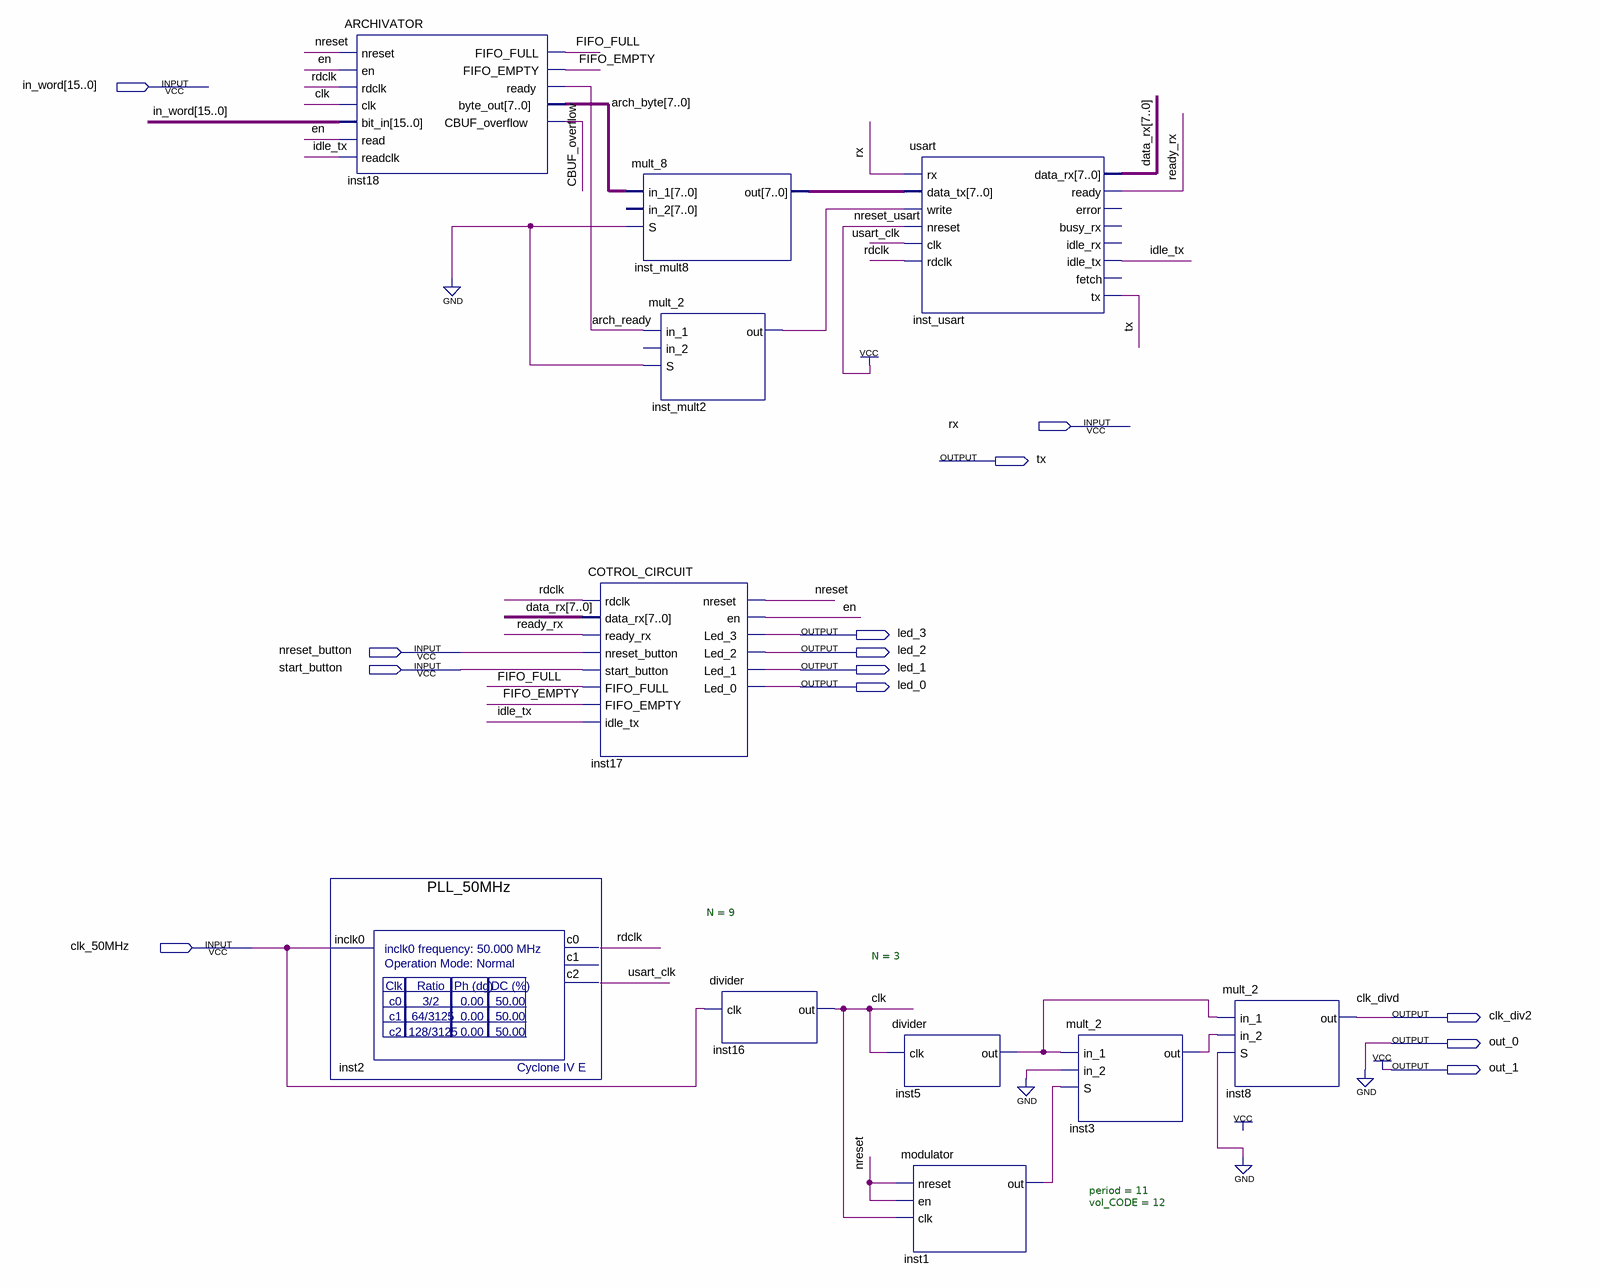
[diagram p0: schematic sheet]
// Quartus schematic TEST_PROJECT_1.bdf as structural Verilog: 11 symbols, 13 pins
module TEST_PROJECT_1 (
  input  [15:0] in_word,
  input  rx,
  input  nreset_button,
  input  start_button,
  input  clk_50MHz,
  output tx,
  output led_3,
  output led_2,
  output led_1,
  output led_0,
  output clk_div2,
  output out_0,
  output out_1
);

  wire arch_ready, CBUF_overflow, clk, en, FIFO_EMPTY, FIFO_FULL, idle_tx, inst1_out, inst3_out, inst5_out,
       inst_mult2_out, nreset, rdclk, ready_rx, usart_clk;
  wire [7:0] arch_byte, data_rx, inst_mult8_out;

  ARCHIVATOR inst18 (
    .nreset(nreset), .en(en), .rdclk(rdclk), .clk(clk), .bit_in(in_word), .read(en), .readclk(idle_tx),
    .FIFO_FULL(FIFO_FULL), .FIFO_EMPTY(FIFO_EMPTY), .ready(arch_ready), .byte_out(arch_byte),
    .CBUF_overflow(CBUF_overflow));
  PLL_50MHz inst2 (.inclk0(clk_50MHz), .c0(rdclk), .c2(usart_clk));  // open: c1
  COTROL_CIRCUIT inst17 (
    .rdclk(rdclk), .data_rx(data_rx), .ready_rx(ready_rx), .nreset_button(nreset_button),
    .start_button(start_button), .FIFO_FULL(FIFO_FULL), .FIFO_EMPTY(FIFO_EMPTY), .idle_tx(idle_tx),
    .nreset(nreset), .en(en), .Led_3(led_3), .Led_2(led_2), .Led_1(led_1), .Led_0(led_0));
  mult_8 inst_mult8 (.in_1(arch_byte), .S(1'b0), .out(inst_mult8_out));  // open: in_2
  mult_2 inst_mult2 (.in_1(arch_ready), .S(1'b0), .out(inst_mult2_out));  // open: in_2
  divider #(.N(9)) inst16 (.clk(clk_50MHz), .out(clk));
  usart inst_usart (
    .rx(rx), .data_tx(inst_mult8_out), .write(inst_mult2_out), .nreset(1'b1), .clk(usart_clk), .rdclk(rdclk),
    .data_rx(data_rx), .ready(ready_rx), .idle_tx(idle_tx), .tx(tx));  // open: error, busy_rx, idle_rx, fetch
  divider #(.N(3)) inst5 (.clk(clk), .out(inst5_out));
  modulator #(.period(11), .vol_CODE(12)) inst1 (.nreset(nreset), .en(nreset), .clk(clk), .out(inst1_out));
  mult_2 inst3 (.in_1(inst5_out), .in_2(1'b0), .S(inst1_out), .out(inst3_out));
  mult_2 inst8 (.in_1(inst5_out), .in_2(inst3_out), .S(1'b0), .out(clk_div2));

  assign out_0 = 1'b0;
  assign out_1 = 1'b1;

  // Other names for the same wires on the sheet: clk_divd = clk_div2
endmodule
